# Altium schematic sheet 1_P1.schdoc
size 309 x 223 mm; Symbol: Sheet-Symbol_A4; Device: Sheet-Symbol_A4; Company: oshwhub.com/laqieer/opencartgba; Drawed: laqieer; Reviewed: laqieer; Version: 1; Page Size: A4; @Project Name: OpenCartGBA; @Page Count: 1; @Update Date: 2022-09-11; @Create Date: 2022-08-30; @Schematic Name: FRAM Save; @Page No: 1; @Page Name: P1
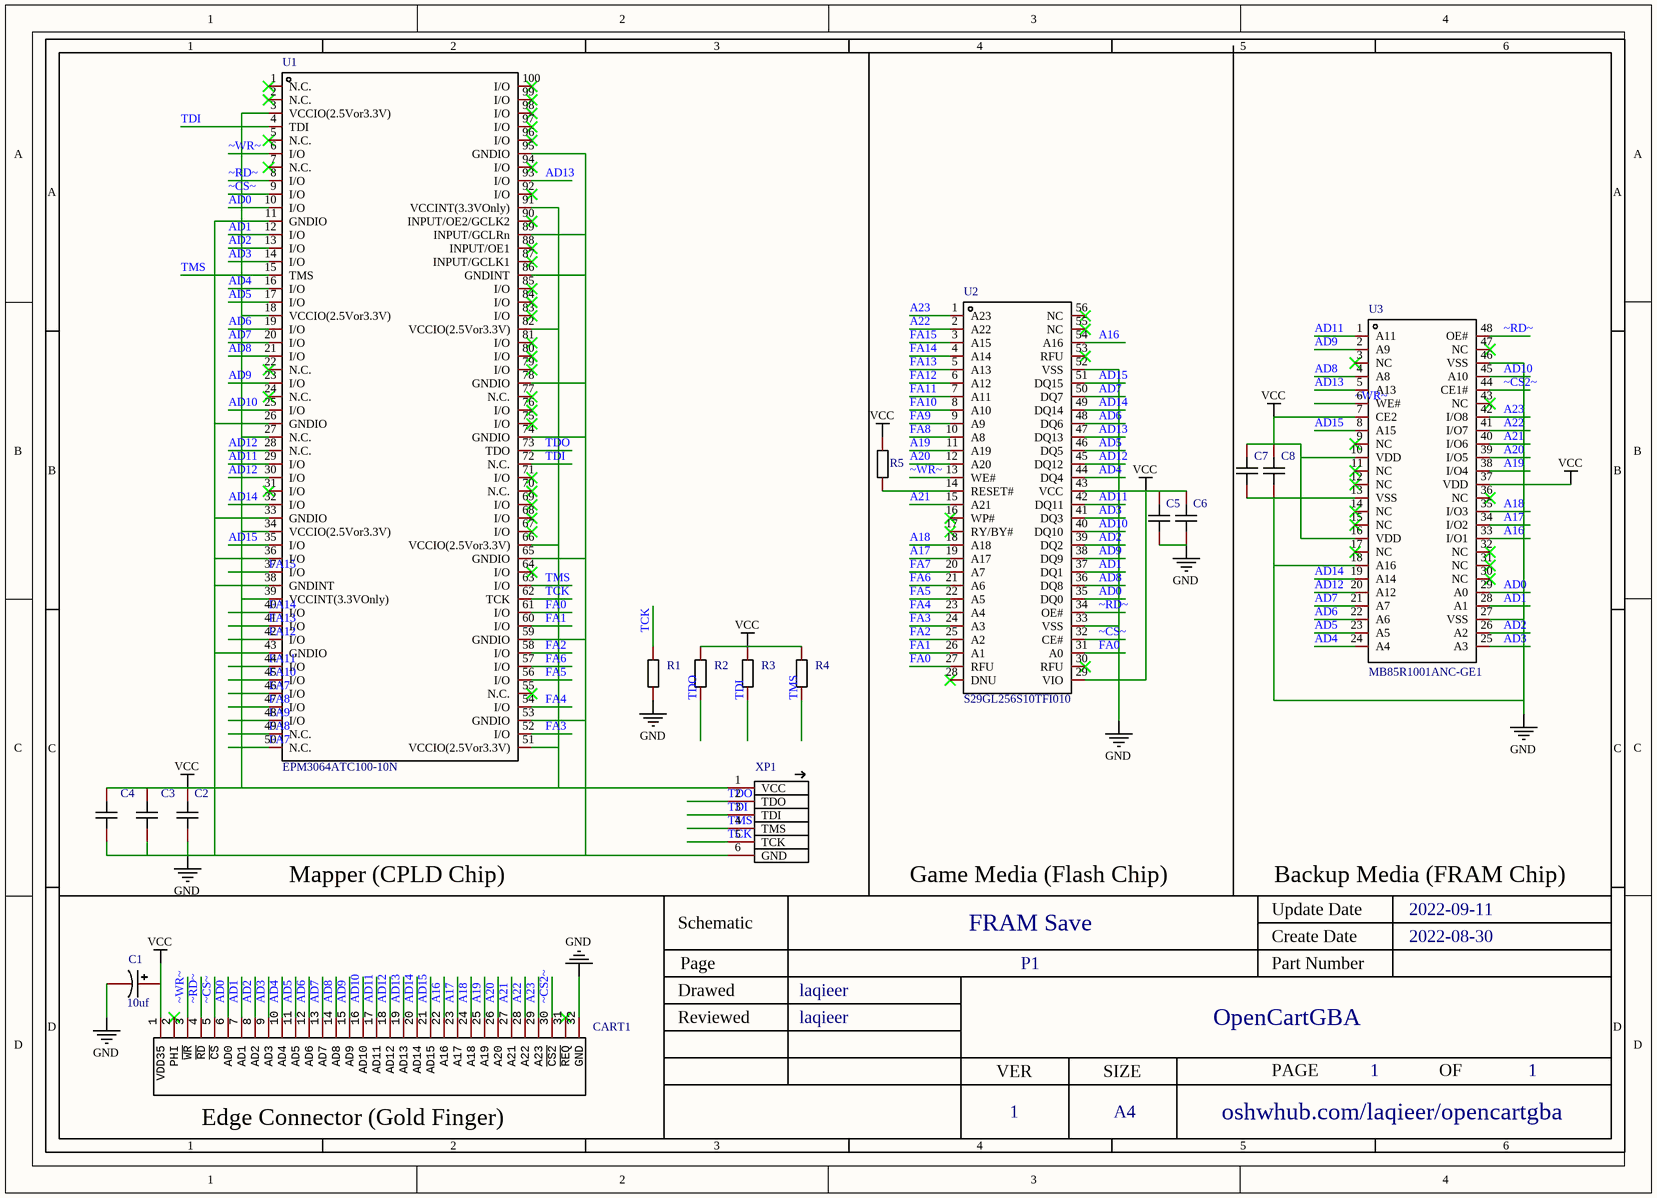
[diagram p0: 1_P1.schdoc]

## Parts
C1  10uf  [CAP-SMD_L2.0-W1.3-FD]
C2  100nF/0603/50V  [C0603]  (value not drawn)
C3  100nF/0603/50V  [C0603]  (value not drawn)
C4  100nF/0603/50V  [C0603]  (value not drawn)
C5  100nF/0603/50V  [C0603]  (value not drawn)
C6  100nF/0603/50V  [C0603]  (value not drawn)
C7  100nF/0603/50V  [C0603]  (value not drawn)
C8  100nF/0603/50V  [C0603]  (value not drawn)
CART1  GBACartridge  [GBACartridge]  (value not drawn)
R1  10kω  [R0603]  (value not drawn)
R2  10kω  [R0603]  (value not drawn)
R3  10kω  [R0603]  (value not drawn)
R4  10kω  [R0603]  (value not drawn)
R5  10kω  [R0603]  (value not drawn)
U1  EPM3064ATC100-10N  [TQFP-100_L14.0-W14.0-P0.50-LS16.0-BL]
U2  S29GL256S10TFI010  [TSOP-56_L18.4-W14.0-P0.50-LS20.0-TL]
U3  MB85R1001ANC-GE1  [TSOP-48_L12.4-W12.2-P0.50-LS14.0-BL]
XP1  jtag  [JTAG_5P-P2.54]  (value not drawn)

## Nets
GND: C1.2 C2.1 C3.2 C4.2 C5.2 C6.2 C7.2 C8.2 CART1.32(GND) R1.1 U1.11(GNDIO) U1.26(GNDIO) U1.33(GNDIO) U1.36(I/O) U1.38(GNDINT) U1.43(GNDIO) U1.53(GNDIO) U1.59(GNDIO) U1.65(GNDIO) U1.74(GNDIO) U1.78(GNDIO) U1.86(GNDINT) U1.89(INPUT/GCLRn) U1.95(GNDIO) U2.33(VSS) U2.52(VSS) U3.13(VSS) U3.18(A16) U3.27(VSS) U3.46(VSS) XP1.6(GND)
VCC: C1.1 C2.2 C3.1 C4.1 C5.1 C6.1 C7.1 C8.1 CART1.1(VDD35) R2.2 R3.2 R4.2 R5.2 U1.3(VCCIO(2.5Vor3.3V)) U1.18(VCCIO(2.5Vor3.3V)) U1.27(N.C.) U1.34(VCCIO(2.5Vor3.3V)) U1.39(VCCINT(3.3VOnly)) U1.51(VCCIO(2.5Vor3.3V)) U1.66(VCCIO(2.5Vor3.3V)) U1.82(VCCIO(2.5Vor3.3V)) U1.91(VCCINT(3.3VOnly)) U2.29(VIO) U2.43(VCC) U3.7(CE2) U3.10(VDD) U3.16(VDD) U3.37(VDD) XP1.1(VCC)
A16: CART1.22(A16) U2.54(A16) U3.33(I/O1)
A17: CART1.23(A17) U2.19(A17) U3.34(I/O2)
A18: CART1.24(A18) U2.18(A18) U3.35(I/O3)
A19: CART1.25(A19) U2.11(A19) U3.38(I/O4)
A20: CART1.26(A20) U2.12(A20) U3.39(I/O5)
A21: CART1.27(A21) U2.15(A21) U3.40(I/O6)
A22: CART1.28(A22) U2.2(A22) U3.41(I/O7)
A23: CART1.29(A23) U2.1(A23) U3.42(I/O8)
AD0: CART1.6(AD0) U1.10(I/O) U2.35(DQ0) U3.29(A0)
AD1: CART1.7(AD1) U1.12(I/O) U2.37(DQ1) U3.28(A1)
AD2: CART1.8(AD2) U1.13(I/O) U2.39(DQ2) U3.26(A2)
AD3: CART1.9(AD3) U1.14(I/O) U2.41(DQ3) U3.25(A3)
AD4: CART1.10(AD4) U1.16(I/O) U2.44(DQ4) U3.24(A4)
AD5: CART1.11(AD5) U1.17(I/O) U2.46(DQ5) U3.23(A5)
AD6: CART1.12(AD6) U1.19(I/O) U2.48(DQ6) U3.22(A6)
AD7: CART1.13(AD7) U1.20(I/O) U2.50(DQ7) U3.21(A7)
AD8: CART1.14(AD8) U1.21(I/O) U2.36(DQ8) U3.4(A8)
AD9: CART1.15(AD9) U1.23(I/O) U2.38(DQ9) U3.2(A9)
AD10: CART1.16(AD10) U1.25(I/O) U2.40(DQ10) U3.45(A10)
AD11: CART1.17(AD11) U1.29(I/O) U2.42(DQ11) U3.1(A11)
AD12: CART1.18(AD12) U1.28(N.C.) U1.30(I/O) U2.45(DQ12) U3.20(A12)
AD13: CART1.19(AD13) U1.93(I/O) U2.47(DQ13) U3.5(A13)
AD14: CART1.20(AD14) U1.32(I/O) U2.49(DQ14) U3.19(A14)
AD15: CART1.21(AD15) U1.35(I/O) U2.51(DQ15) U3.8(A15)
FA0: U1.61(I/O) U2.27(RFU) U2.31(A0)
FA1: U1.60(I/O) U2.26(A1)
FA2: U1.58(I/O) U2.25(A2)
FA3: U1.52(I/O) U2.24(A3)
FA4: U1.54(I/O) U2.23(A4)
FA5: U1.56(I/O) U2.22(A5)
FA6: U1.57(I/O) U2.21(A6)
FA7: U1.46(I/O) U1.50(N.C.) U2.20(A7)
FA8: U1.47(I/O) U1.49(N.C.) U2.10(A8)
FA9: U1.48(I/O) U2.9(A9)
FA10: U1.45(I/O) U2.8(A10)
FA11: U1.44(I/O) U2.7(A11)
FA12: U1.42(I/O) U2.6(A12)
FA13: U1.41(I/O) U2.5(A13)
FA14: U1.40(I/O) U2.4(A14)
FA15: U1.37(I/O) U2.3(A15)
TCK: R1.2 U1.62(TCK) XP1.5(TCK)
TDI: R3.1 U1.4(TDI) U1.72(N.C.) XP1.3(TDI)
TDO: R2.1 U1.73(TDO) XP1.2(TDO)
TMS: R4.1 U1.15(TMS) U1.63(I/O) XP1.4(TMS)
~CS2~: CART1.30(~{CS2}) U3.44(CE1#)
~CS~: CART1.5(~{CS}) U1.9(I/O) U2.32(CE#)
~RD~: CART1.4(~{RD}) U1.8(I/O) U2.34(OE#) U3.48(OE#)
~WR~: CART1.3(~{WR}) U1.6(I/O) U2.13(WE#) U3.6(WE#)
NetR5_1: R5.1 U2.14(RESET#)

Not connected (* = marked no-connect by the designer): CART1 2(PHI)* 31(~{REQ})*; U1 1(N.C.)* 2(N.C.)* 5(N.C.)* 7(N.C.)* 22(N.C.)* 24(N.C.)* 31(I/O)* 55(N.C.)* 64(I/O)* 67(I/O)* 68(I/O)* 69(I/O)* 70(N.C.)* 71(I/O)* 75(I/O)* 76(I/O)* 77(N.C.)* 79(I/O)* 80(I/O)* 81(I/O)* 83(I/O)* 84(I/O)* 85(I/O)* 87(INPUT/GCLK1)* 88(INPUT/OE1)* 90(INPUT/OE2/GCLK2)* 92(I/O)* 94(I/O)* 96(I/O)* 97(I/O)* 98(I/O)* 99(I/O)* 100(I/O)*; U2 16(WP#)* 17(RY/BY#)* 28(DNU)* 30(RFU)* 53(RFU)* 55(NC)* 56(NC)*; U3 3(NC)* 9(NC)* 11(NC)* 12(NC)* 14(NC)* 15(NC)* 17(NC)* 30(NC)* 31(NC)* 32(NC)* 36(NC)* 43(NC)* 47(NC)*

## Notes on the sheet
- Mapper (CPLD Chip)
- Game Media (Flash Chip)
- Backup Media (FRAM Chip)
- Edge Connector (Gold Finger)
- 1
- 2
- 3
- 4
- 5
- 6
- A
- B
- C
- Schematic
- FRAM Save
- Create Date
- Update Date
- 2022-09-11
- 2022-08-30
- Reviewed
- Drawed
- Page
- laqieer
- P1
- Part Number
- OpenCartGBA
- D
- VER
- SIZE
- PAGE
- OF
- A4
- oshwhub.com/laqieer/opencartgba

## Library data of the parts
C1 = 10uf: Symbol: 10UF_C9900016685; Add into BOM: yes; Name: 10uf; Device: 10uf; LCSC Part Name: 10uf; Supplier Part: C9900016685; Manufacturer Part: 10uf; Supplier Footprint: SMD,2x1.25x1.2mm; JLCPCB Part Class: Extended Part; Datasheet: https://atta.szlcsc.comnull; Supplier: LCSC; Convert to PCB: yes
C2-C8 = 100nF/0603/50V: Add into BOM: yes; Name: 100nF/0603/50V; Symbol: 100NF/0603/50V; Device: 100nF/0603/50V; LCSC Part Name: 100nF/0603/50V; Supplier Part: C9900013340; Manufacturer Part: 100nF/0603/50V; Supplier Footprint: C0603; JLCPCB Part Class: Extended Part; Datasheet: https://atta.szlcsc.comnull; Supplier: LCSC; Convert to PCB: yes
CART1 = GBACartridge: GBA Cartridge; Convert to PCB: yes; Add into BOM: no; Symbol: GBACartridge; Device: GBACartridge
R1-R5 = 10kω: 电阻类型:薄膜电阻;阻值:10kΩ;精度:±0.1%;功率:100mW;温度系数:±25ppm/;最大工作电压:75V;工作温度范围:-55~+155;; Manufacturer: EVER OHMS(天二科技); Manufacturer Part: TR0603B10K0P0525Z; Symbol: TR0603B10KP05250.1W; Add into BOM: yes; Tolerance: ±0.1%; Power(Watts): 100mW; Temperature Coefficient: ±25ppm/; Overload Voltage (Max): 75V; Device: 10kω; LCSC Part Name: 10kΩ ±0.1% 100mW; Supplier Part: C188363; Supplier Footprint: 0603; JLCPCB Part Class: Extended Part; Datasheet: https://atta.szlcsc.com/upload/public/pdf/source/20190415/C188363_433BF05B6FB8F7A0F5F35A3E4390C55A.pdf; Supplier: LCSC; Convert to PCB: yes; Type: 薄膜电阻; Value: 10kΩ; Operating Temperature Range: -55~+155
U1 = EPM3064ATC100-10N: 可编程类型:-;逻辑元件/块数:-;宏单元数:-;I/O 数:-;工作温度:-;; Manufacturer: Intel/Altera; Add into BOM: yes; Name: EPM3064ATC100-10N; Symbol: EPM3064ATC100-10N; Device: EPM3064ATC100-10N; LCSC Part Name: EPM3064ATC100-10N; Supplier Part: C34245; Manufacturer Part: EPM3064ATC100-10N; Supplier Footprint: TQFP-100_14x14x05P; JLCPCB Part Class: Extended Part; Datasheet: https://atta.szlcsc.com/upload/public/pdf/source/20140723/1457707156998.pdf; Supplier: LCSC; Convert to PCB: yes; Programmable Type: -; Number of Logic Elements/Blocks: -; Number of Macrocells: -; Number of I/O: -; Operating Temperature: -
U2 = S29GL256S10TFI010: Manufacturer: SPANSION(飞索); Add into BOM: yes; Name: S29GL256S10TFI010; Symbol: S29GL256S10TFI010; Device: S29GL256S10TFI010; LCSC Part Name: S29GL256S10TFI010; Supplier Part: C1350995; Manufacturer Part: S29GL256S10TFI010; Supplier Footprint: TSOP-56; JLCPCB Part Class: Extended Part; Datasheet: https://atta.szlcsc.com/upload/public/pdf/source/20201109/C914940_4A5E28132C9BE0EE19A790F58F84C86D.pdf; Supplier: LCSC; Convert to PCB: yes
U3 = MB85R1001ANC-GE1: 存储器容量:1Mb (128K x 8);存储器接口类型:Parallel;工作电压:3V ~ 3.6V;; Manufacturer: FUJITSU(富士通); Add into BOM: yes; Memory Format: FRAM; Name: MB85R1001ANC-GE1; Symbol: MB85R1001ANC-GE1; Device: MB85R1001ANC-GE1; LCSC Part Name: MB85R1001ANC-GE1; Supplier Part: C126736; Manufacturer Part: MB85R1001ANC-GE1; Supplier Footprint: TSOP-48; JLCPCB Part Class: Extended Part; Datasheet: https://atta.szlcsc.com/upload/public/pdf/source/20170821/C126736_1503303359319901614.pdf; Supplier: LCSC; Convert to PCB: yes; Memory Size: 1Mb (128K x 8); Memory Interface: Parallel; Voltage - Supply: 3V ~ 3.6V
XP1 = jtag: Convert to PCB: yes; Add into BOM: no; Symbol: jtag; Device: jtag; Value: JTAG